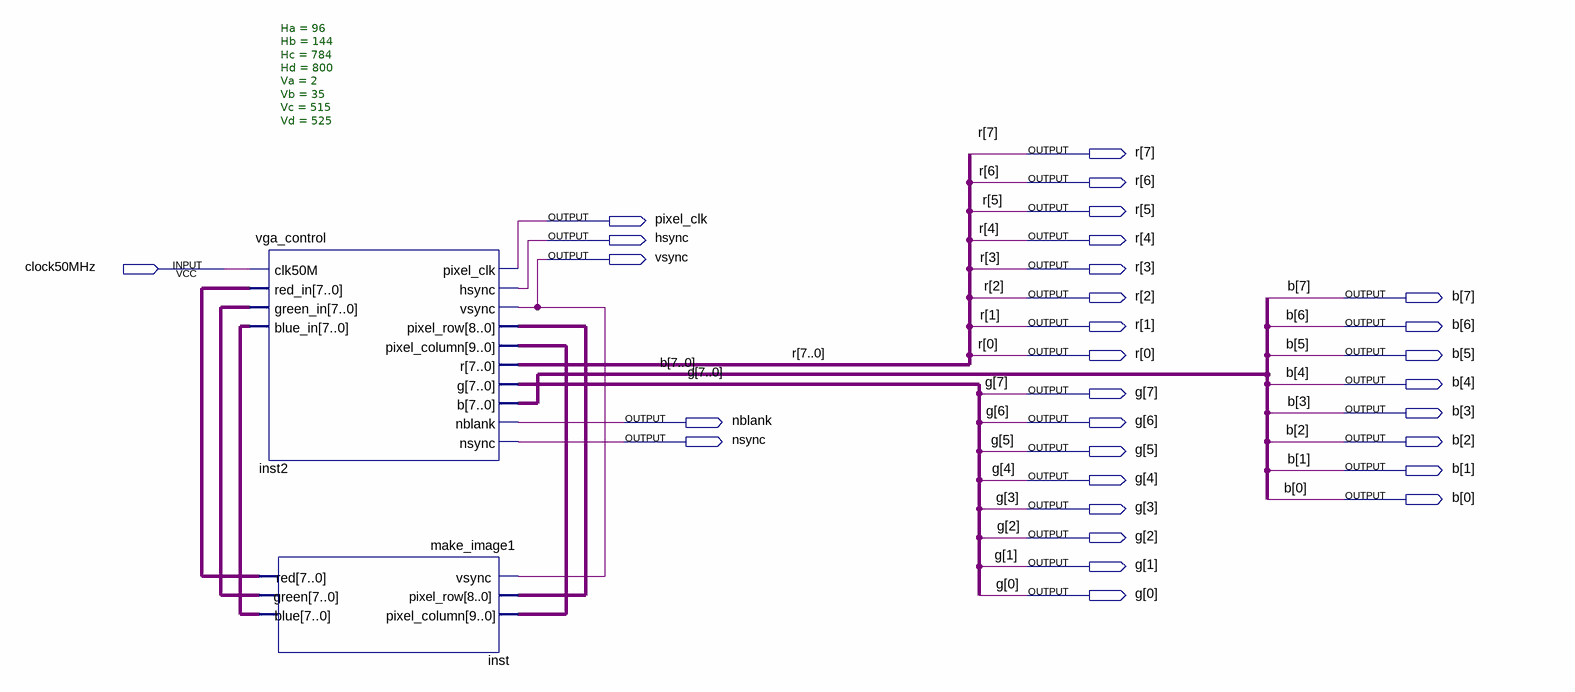
[diagram p0: schematic sheet]
// Quartus schematic VGA.bdf as structural Verilog: 2 symbols, 30 pins
module VGA (
  input  clock50MHz,
  output [7:0] r,
  output pixel_clk,
  output hsync,
  output vsync,
  output [7:0] b,
  output [7:0] g,
  output nblank,
  output nsync
);

  wire [7:0] inst_blue, inst_green, inst_red;
  wire [8:0] inst2_pixel_row;
  wire [9:0] inst2_pixel_column;

  vga_control #(.Ha(96), .Hb(144), .Hc(784), .Hd(800), .Va(2), .Vb(35), .Vc(515), .Vd(525)) inst2 (
    .clk50M(clock50MHz), .red_in(inst_red), .green_in(inst_green), .blue_in(inst_blue),
    .pixel_clk(pixel_clk), .hsync(hsync), .vsync(vsync), .pixel_row(inst2_pixel_row),
    .pixel_column(inst2_pixel_column), .r(r), .g(g), .b(b), .nblank(nblank), .nsync(nsync));
  make_image1 inst (
    .vsync(vsync), .pixel_row(inst2_pixel_row), .pixel_column(inst2_pixel_column), .red(inst_red),
    .green(inst_green), .blue(inst_blue));
endmodule
